# EAGLE design eeZeeAmp (EAGLE 7.1.0)
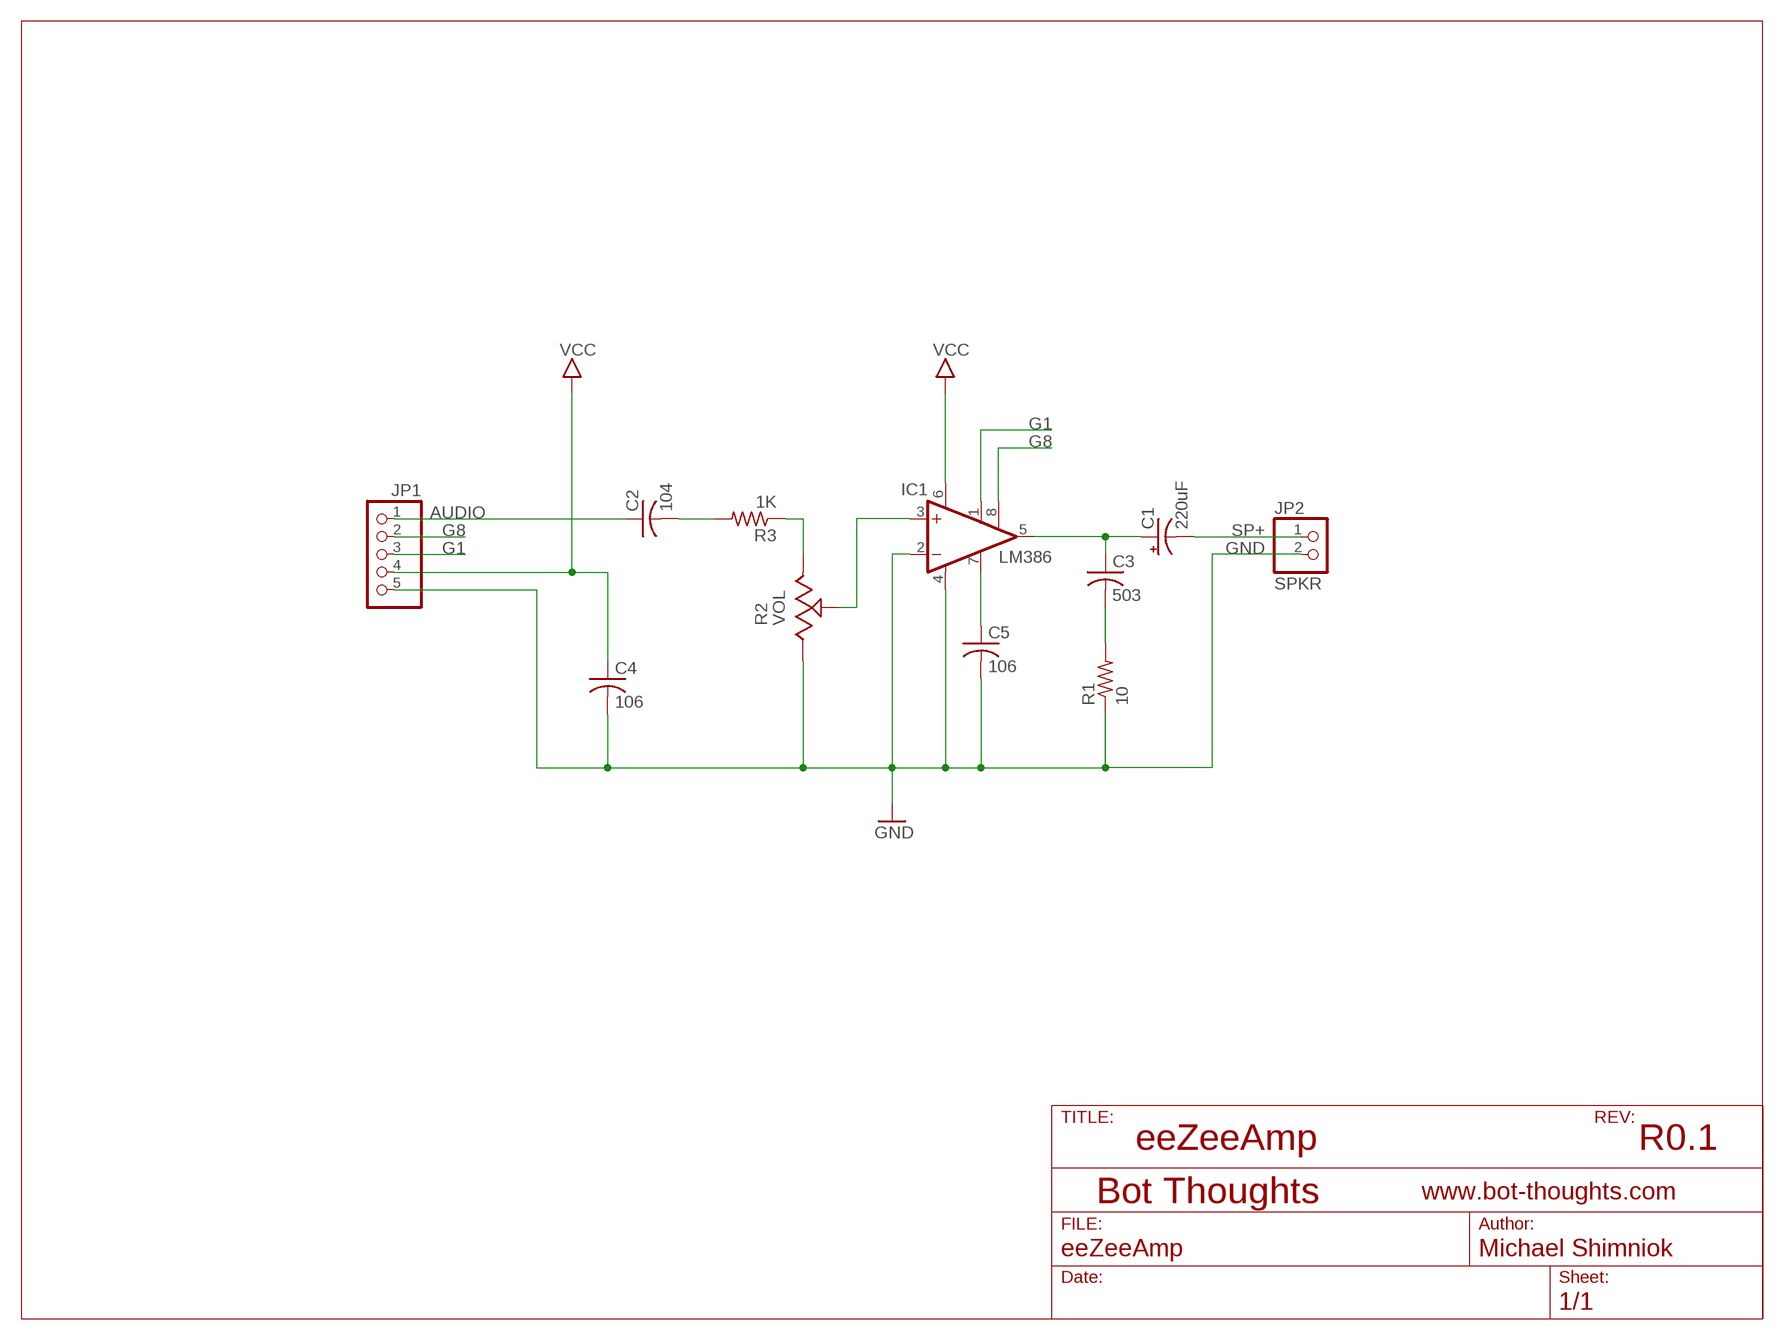
[diagram p0: schematic, sheet 1]

## Parts
C1  220uF  CPOL-USE2.5-6  [E2,5-6]
C2  104  C-USC0603  [C0603]
C3  503  C-USC0603  [C0603]
C4  106  C-USC1206  [C1206]
C5  106  C-USC1206  [C1206]
IC1  LM386  LM386M-1  [SO08]
JP1  PINHD-1X05_2.54-S  [1X05-S]
JP2  SPKR  PINHD-1X02_2.54-S  [1X02-S]
R1  10  R-US_R0603  [R0603]
R2  VOL  TRIM_US-  [OFFBOARD_POT_3]
R3  1K  R-US_R0603  [R0603]

## Nets
AUDIO: C2.1 JP1.1
G1: IC1.1(GAIN) JP1.3
G8: IC1.8(GAIN) JP1.2
GND: C4.2 C5.2 IC1.2(-IN) IC1.4(GND) JP1.5 JP2.2 R1.1 R2.P$1(A)
N$1: IC1.3(+IN) R2.P$2(S)
N$2: C2.2 R3.2
N$3: C1.+ C3.1 IC1.5(OUT)
N$4: C3.2 R1.2
N$7: C5.1 IC1.7(BYPASS)
N$8: R2.P$3(E) R3.1
SP+: C1.- JP2.1
VCC: C4.1 IC1.6(VS) JP1.4

## Notes on the sheet
- eeZeeAmp | R0.1

## Library data of the parts
C1 = rcl:CPOL-US: POLARIZED CAPACITOR, American symbol
C2-C5 = rcl:C-US: CAPACITOR, American symbol
IC1 = linear:LM386?-*: Low Voltage Audio Power Amplifier Source: http://cache.national.com/ds/LM/LM386.pdf
JP1 = pinhead-2:PINHD-1X05: PIN HEADER
JP2 = pinhead-2:PINHD-1X02: PIN HEADER
R1 R3 = resistor:R-US_: RESISTOR, American symbol
R2 = bt:TRIM_US-: POTENTIOMETER

## Board
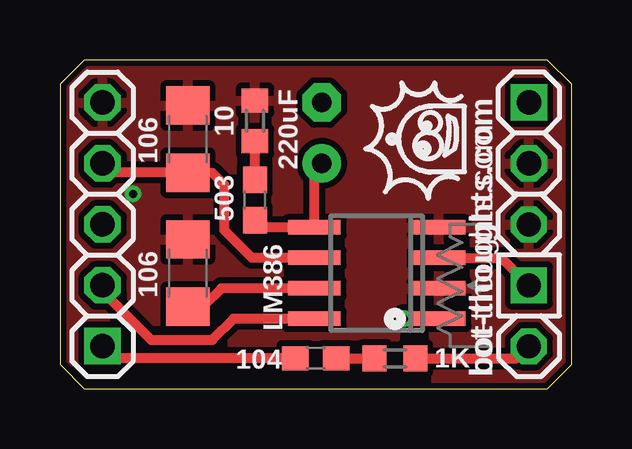
[diagram p1: board, top side]
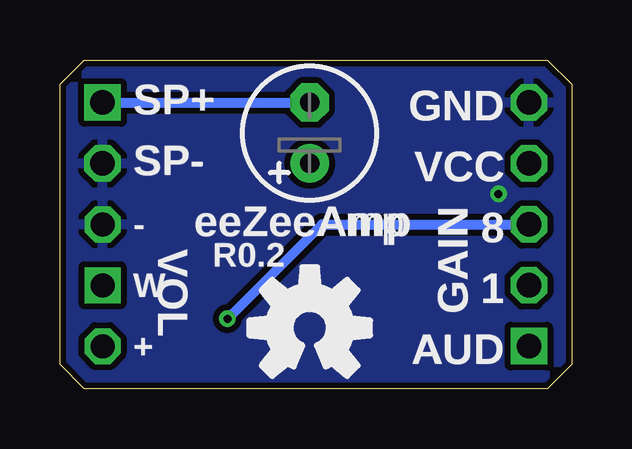
[diagram p2: board, bottom side, seen from below]

Size 21.34 x 13.72 mm. Coordinates in mm from the lower left corner, seen from the top.
Outline: 0,12.7 0,1.02 1.02,0 20.32,0 21.34,1.02 21.34,12.7 20.32,13.72 1.02,13.72 0,12.7
Copper layers (1*16): Top 0.0356mm / dielectric 1.5011mm / Bottom 0.0356mm
Design rules "LaenPCBOrder *": minimum track width 6mil, minimum drill 13mil, track to track 10mil, track to pad 10mil, pad to pad 10mil, via to via 10mil, smd to smd 8mil, copper to edge 10mil, drill to drill 10mil, minimum pad ring 7mil, minimum via ring 7mil, stop-mask expansion 3mil, vias tented up to drill 20mil, thermal gap 10mil

### Footprints (pad centres in the part's own frame; a part is rotated, then mirrored left to right if it is on the bottom)
E2,5-6 = drill 0.813 pad 1.6: + -1.27,0 | drill 0.813 pad 1.6 octagon: - 1.27,0
C0603 = smd 1.1 x 1: 1 -0.85,0; 2 0.85,0
C1206 = smd 1.6 x 1.8: 1 -1.4,0; 2 1.4,0
SO08 = smd 0.6 x 2.2: 1 -1.905,-2.6; 2 -0.635,-2.6; 3 0.635,-2.6; 4 1.905,-2.6; 5 1.905,2.6; 6 0.635,2.6; 7 -0.635,2.6; 8 -1.905,2.6
1X05-S = drill 1.016 square: 1 -5.08,0 | drill 1.016 octagon: 2 -2.54,0; 3 0,0; 4 2.54,0; 5 5.08,0
1X02-S = drill 1.016 square: 1 -1.27,0 | drill 1.016 octagon: 2 1.27,0
R0603 = smd 1 x 1.1: 1 -0.85,0; 2 0.85,0
OFFBOARD_POT_3 = drill 1 octagon: P$1 -2.54,0; P$3 2.54,0 | drill 1 square: P$2 0,0

### Placement (x,y rotation side)
C1  10.92,10.67 90 bottom
C2  10.67,1.27 0 top
C3  8.13,7.87 90 top
C4  5.33,10.41 90 top
C5  5.33,4.83 90 top
IC1  13.21,4.83 90 top
JP1  1.78,6.86 90 top
JP2  19.56,10.67 270 top
R1  8.13,11.18 270 top
R2  19.56,4.32 270 top
R3  13.97,1.27 180 top

### Tracks (layer width: path | path; a pad name or v marks a point on that pad's centre or on a via)
AUDIO
  Top 0.406: C2.1 2.29,1.27 JP1.1
G1  (via drill 0.33)
  Top 0.406: IC1.1 v14.35,2.92
  Bottom 0.406: v14.35,2.92 10.41,6.86 JP1.3
G8
  Top 0.406: JP1.2 1.78,4.06 3.81,2.03 6.35,2.03 7.24,2.92 IC1.8
GND  (via drill 0.33)
  other vias: 3.05,8.13
  pour Bottom: 1.02,13.72 20.32,13.72 21.34,12.7 21.34,1.02 20.32,0 1.02,0 0,1.02 0,12.7
  pour Top: 1.02,13.72 20.32,13.72 21.34,12.7 21.34,1.02 20.32,0 1.02,0 0,1.02 0,12.7
N$1
  Top 0.406: IC1.3 18.41,5.46 R2.P$2
N$2
  Top 0.406: C2.2 R3.2
N$3
  Top 0.406: C1.+ 10.61,9.08 IC1.5 8.42,6.73 C3.1
N$4
  Top 0.406: C3.2 R1.2
N$7
  Top 0.406: IC1.7 6.73,4.19 5.97,3.43 C5.1
N$8
  Top 0.406: R3.1 19.05,1.27 R2.P$3
SP+
  Bottom 0.406: JP2.1 C1.-
VCC
  Top 0.406: JP1.4 2.16,9.01 C4.1 6.35,9.01 6.86,8.51 6.86,6.6 8,5.46 IC1.6

### Text on the board
tNames: bot-thoughts.com
bNames: GND | SP+ | VCC | SP- | GAIN | 8 | eeZeeAmp | - | 1 | R0.2 | W | AUD | +
tsilk: 10 | 106 | 220uF | 503 | 106 | 104 | LM386 | 1K | bot-thoughts.com
bsilk: GND | SP+ | VCC | SP- | GAIN | 8 | eeZeeAmp | VOL | - | 1 | R0.2 | W | AUD | +